# Altium project ANT_Miner_V1.3.PrjPCB (part 1 of 2)
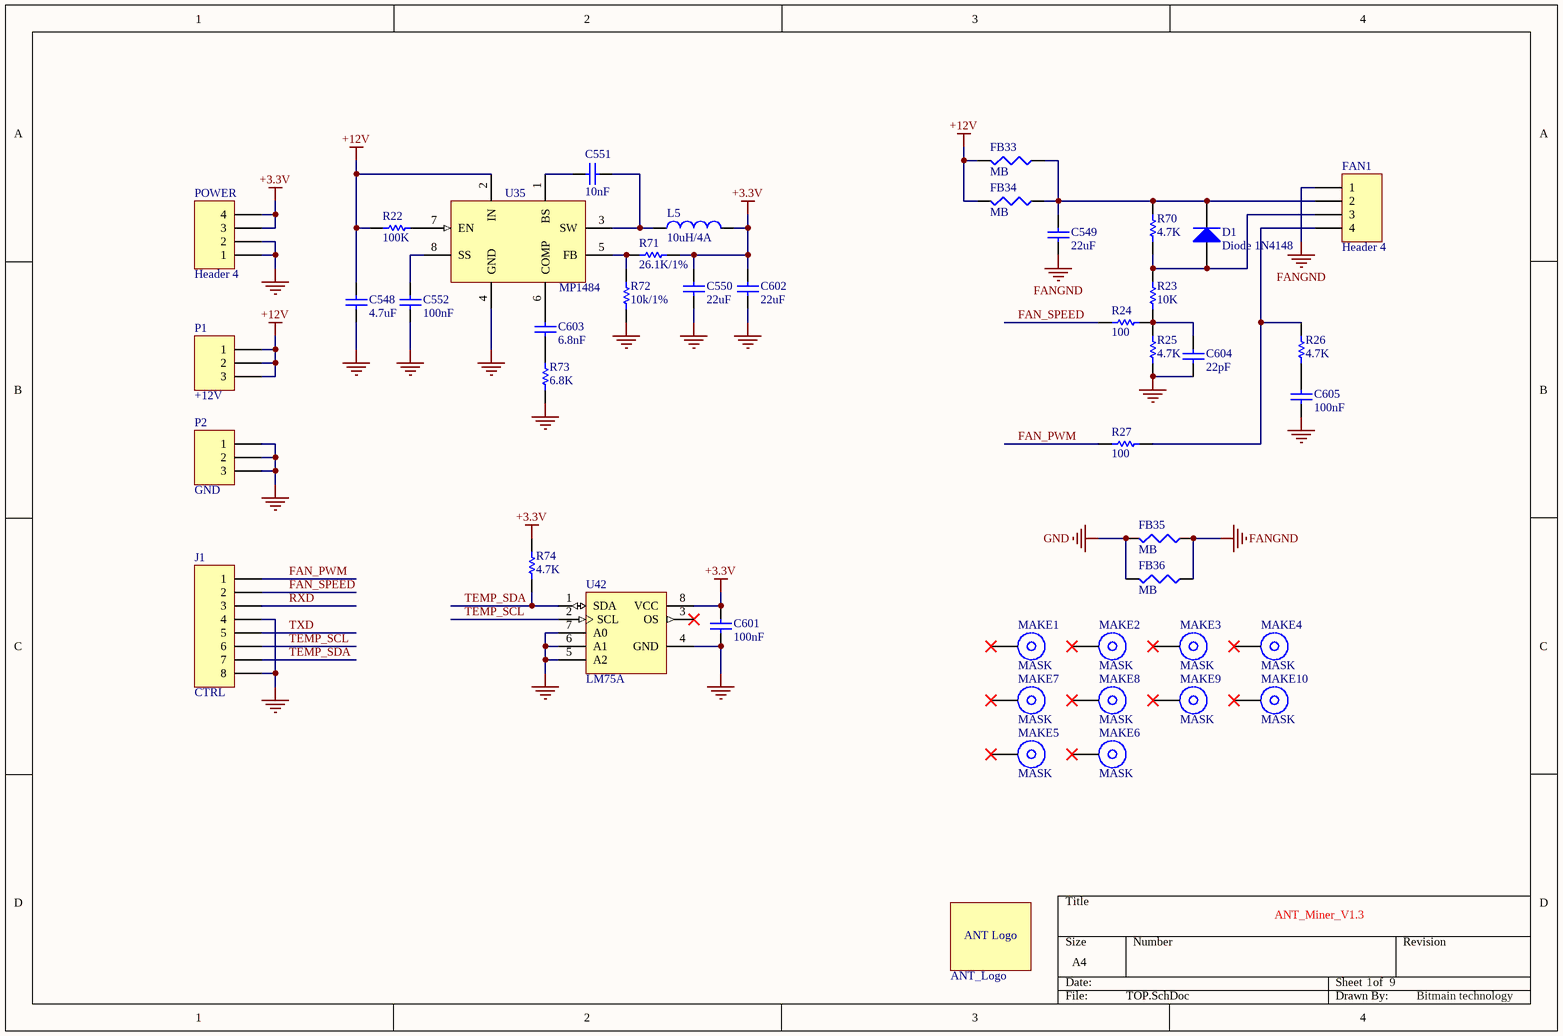
[diagram p0: TOP.SchDoc]
9 sheets, 987 parts. Net scope: global (net labels, ports and power ports of the same name join across sheets).
Board file: BitMainTech_V1.3.PcbDoc
Sheets:
  TOP.SchDoc
  HashPower1.SchDoc
  HashPower2.SchDoc
  HashPower3.SchDoc
  HashPower4.SchDoc
  HashUnit1.SchDoc
  HashUnit2.SchDoc
  HashUnit3.SchDoc
  HashUnit4.SchDoc

## Sheet TOP.SchDoc: ANT_Miner_V1.3
size A4; Date: 2013/11/20; DrawnBy: Bitmain technology; SheetNumber: 1; SheetTotal: 9

### Parts
?  ANT_Logo  [ANT_Logo_930x370]
C548  4.7uF  [CAP1210(3225)_TAN]
C549  22uF  [CAP1210(3225)_TAN]
C550  22uF  [CAP1210(3225)_TAN]
C551  10nF  [CC0603(1608)]
C552  100nF  [CC0603(1608)]
C601  100nF  [CC0603(1608)]
C602  22uF  [CAP1210(3225)_TAN]
C603  6.8nF  [CC0603(1608)]
C604  22pF  [CC0603(1608)]
C605  100nF  [CC0603(1608)]
D1  Diode 1N4148  [CD3216-1206]
FAN1  Header 4  [4PINFAN]
FB33  MB  [INDC3216L]
FB34  MB  [INDC3216L]
FB35  MB  [INDC3216L]
FB36  MB  [INDC3216L]
J1  CTRL  [8Pin_180]
L5  10uH/4A  [SMD_L_7.4x7.4]
MAKE1  MASK  [MASK]
MAKE2  MASK  [MASK]
MAKE3  MASK  [MASK]
MAKE4  MASK  [MASK]
MAKE5  MASK  [MASK]
MAKE6  MASK  [MASK]
MAKE7  MASK  [MASK]
MAKE8  MASK  [MASK]
MAKE9  MASK  [MASK]
MAKE10  MASK  [MASK]
P1  +12V  [TERMINAL_3]
P2  GND  [TERMINAL_3]
POWER  Header 4  [4Pin_180]
R22  100K  [RR0603(1608)]
R23  10K  [RR0603(1608)]
R24  100  [RR0603(1608)]
R25  4.7K  [RR0603(1608)]
R26  4.7K  [RR0603(1608)]
R27  100  [RR0603(1608)]
R70  4.7K  [RR0603(1608)]
R71  26.1K/1%  [RR0603(1608)]
R72  10k/1%  [RR0603(1608)]
R73  6.8K  [RR0603(1608)]
R74  4.7K  [RR0603(1608)]
U35  MP1484  [SOIC8L]
U42  LM75A  [SO8_L]

### Nets
+3.3V: C550.2 C601.1 C602.2 L5.2 POWER.3 POWER.4 R71.1 R74.2 U42.8(VCC)
+12V: C548.2 FB33.2 FB34.2 P1.1 P1.2 P1.3 R22.2 U35.2(IN)
FANGND: C549.1 FAN1.1 FB35.1 FB36.1
GND: C548.1 C550.1 C552.2 C601.2 C602.1 C604.2 C605.2 FB35.2 FB36.2 J1.4 J1.8 P2.1 P2.2 P2.3 POWER.1 POWER.2 R25.1 R72.1 R73.1 U35.0 U35.4(GND) U42.4(GND) U42.5(A2) U42.6(A1) U42.7(A0)
FAN_PWM: J1.1 R27.2
FAN_SPEED: J1.2 R24.2
RXD: J1.3
TEMP_SCL: J1.6 U42.2(SCL)
TEMP_SDA: J1.7 R74.1 U42.1(SDA)
TXD: J1.5
NetC549_2: C549.2 D1.2(K) FAN1.2 FB33.1 FB34.1 R70.2
NetC551_1: C551.1 U35.1(BS)
NetC551_2: C551.2 L5.1 U35.3(SW)
NetC552_1: C552.1 U35.8(SS)
NetC603_1: C603.1 U35.6(COMP)
NetC603_2: C603.2 R73.2
NetC604_1: C604.1 R23.2 R24.1 R25.2
NetC605_1: C605.1 R26.1
NetD1_1: D1.1(A) FAN1.3 R23.1 R70.1
NetFAN1_4: FAN1.4 R26.2 R27.1
NetR22_1: R22.1 U35.7(EN)
NetR71_2: R71.2 R72.2 U35.5(FB)

Not connected (* = marked no-connect by the designer): MAKE1 1*; MAKE2 1*; MAKE3 1*; MAKE4 1*; MAKE5 1*; MAKE6 1*; MAKE7 1*; MAKE8 1*; MAKE9 1*; MAKE10 1*; U42 3(OS)*

### Notes on the sheet
- (in symbol ANT_Logo) ANT Logo

### Library data of the parts
C548-C552 C601-C605 = Cap Semi: Capacitor (Semiconductor SIM Model); Published: 8-Jun-2000; LatestRevisionDate: 29-May-2009; LatestRevisionNote: IPC-7351 Footprint Added.; PackageReference: C1206; Publisher: Altium Limited; PackageDescription: Chip Capacitor
  C548: Value: 4.7uF
  C549 C550 C602: Value: 22uF
  C551: Value: 10nF
  C552 C601 C605: Value: 100nF
  C603: Value: 6.8nF
  C604: Value: 22pF
D1 = Diode 1N4148: High Conductance Fast Diode; Published: 8-Jun-2000; LatestRevisionDate: 17-Jul-2002; LatestRevisionNote: Re-released for DXP Platform.; DatasheetVersion: 1997; PackageReference: DO-35; Publisher: Altium Limited; PackageDescription: Diode, Axial; Body 3.8 x 1.9 mm (LxDia. max), Lead Dia. 0.53 mm (max); Code_JEDEC: DO-204-AH; ComponentLink1Description: Manufacturer Link; ComponentLink1URL: http://www.fairchildsemi.com/; ComponentLink2Description: Datasheet; ComponentLink2URL: http://www.fairchildsemi.com/ds/1N%2F1N4148.pdf
FAN1 POWER = Header 4: Header, 4-Pin; LatestRevisionDate: 17-Jul-2002; LatestRevisionNote: Re-released for DXP Platform.; Publisher: Altium Limited
FB33-FB36 = Res3: Resistor; Published: 8-Jun-2000; LatestRevisionDate: 29-May-2009; LatestRevisionNote: IPC-7351 Footprint Added.; PackageReference: J1-0603; Publisher: Altium Limited; PackageDescription: Chip Resistor; Value: MB
J1 = Header 8: Header, 8-Pin; LatestRevisionDate: 17-Jul-2002; LatestRevisionNote: Re-released for DXP Platform.; Publisher: Altium Limited
L5 = Inductor: Code_IEC: 1005; Published: 8-Jun-2000; LatestRevisionDate: 29-May-2009; LatestRevisionNote: IPC-7351 Footprint Added.; PackageReference: 0402-A; Publisher: Altium Limited; PackageDescription: Chip Inductor; Code_JEITA: 0402; Value: 10uH/4A
P1 P2 = Header 3: Header, 3-Pin; LatestRevisionDate: 17-Jul-2002; LatestRevisionNote: Re-released for DXP Platform.; Publisher: Altium Limited
R22-R27 R70-R74 = Res1: Resistor; Published: 8-Jun-2000; LatestRevisionDate: 17-Jul-2002; LatestRevisionNote: Re-released for DXP Platform.; PackageReference: AXIAL-0.3; Publisher: Altium Limited; PackageDescription: Axial Device, Thru-Hole; 2 Leads; 0.3 in Pin Spacing
  R22: Value: 100K
  R23: Value: 10K
  R24 R27: Value: 100
  R25 R26 R70 R74: Value: 4.7K
  R71: Value: 26.1K/1%
  R72: Value: 10k/1%
  R73: Value: 6.8K
U42 = LM75A: NXP Digital temperature sensor and thermal watchdog

## Sheet HashPower1.SchDoc: ANT_Miner_V1.3
size A4; Date: 2013/11/20; DrawnBy: Bitmain Technology; SheetNumber: 2; SheetTotal: 9
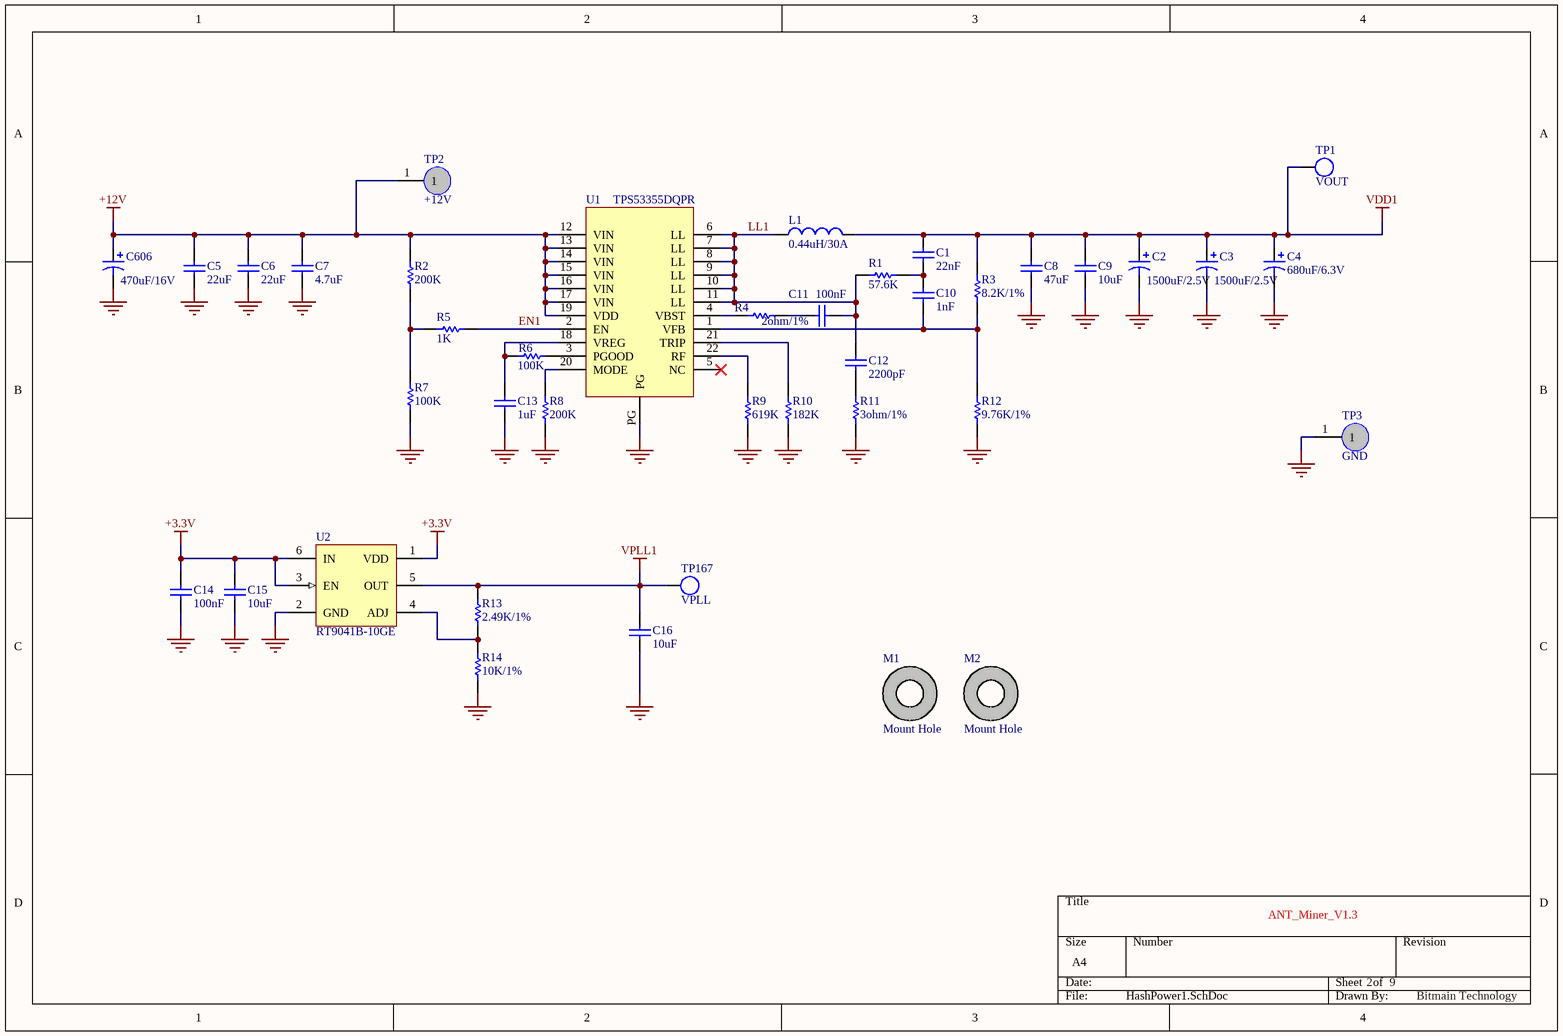
[diagram p1: HashPower1.SchDoc]

### Parts
C1  22nF  [CC0603(1608)]
C2  value 1500uF/2.5V  [F12]  (hidden comment: 1500uF/4V)
C3  value 1500uF/2.5V  [F12]  (hidden comment: 1500uF/4V)
C4  680uF/6.3V  [D]
C5  22uF  [CC1210(3225)]
C6  22uF  [CC1210(3225)]
C7  4.7uF  [CC0805(2012)]
C8  47uF  [CAPC3225L]
C9  10uF  [CAPC2012L]
C10  1nF  [CC0603(1608)]
C11  100nF  [CC0603(1608)]
C12  2200pF  [CC0603(1608)]
C13  1uF  [CC0603(1608)]
C14  100nF  [CC0603(1608)]
C15  10uF  [CC0805(2012)]
C16  10uF  [CC0805(2012)]
C606  470uF/16V  [E12]
L1  0.44uH/30A  [IHLP5050]
M1  Mount Hole  [HOLE_3.2]
M2  Mount Hole  [HOLE_3.2]
R1  57.6K  [RR0603(1608)]
R2  200K  [RR0603(1608)]
R3  8.2K/1%  [RR0603(1608)]
R4  value 2ohm/1%  [RR0603(1608)]  (hidden comment: 2)
R5  1K  [RR0603(1608)]
R6  100K  [RR0603(1608)]
R7  100K  [RR0603(1608)]
R8  200K  [RR0603(1608)]
R9  619K  [RR0603(1608)]
R10  182K  [RR0603(1608)]
R11  value 3ohm/1%  [RR0603(1608)]  (hidden comment: 3)
R12  9.76K/1%  [RR0603(1608)]
R13  2.49K/1%  [RR0603(1608)]
R14  10K/1%  [RR0603(1608)]
TP1  VOUT  [TP_SMD_1.0]
TP2  +12V  [TP]
TP3  GND  [TP]
TP167  VPLL  [TP_SMD_1.0]
U1  TPS53355DQPR  [TPS53355]
U2  RT9041B-10GE  [SOT23-6_L]

### Nets
+3.3V: C14.2 C15.2 U2.1(VDD) U2.3(EN) U2.6(IN)
+12V: C5.1 C6.1 C7.1 C606.1 R2.1 TP2.1 U1.12(VIN) U1.13(VIN) U1.14(VIN) U1.15(VIN) U1.16(VIN) U1.17(VIN) U1.19(VDD)
GND: C2.2 C3.2 C4.2 C5.2 C6.2 C7.2 C8.1 C9.1 C13.2 C14.1 C15.1 C16.1 C606.2 R7.2 R8.2 R9.2 R10.2 R11.2 R12.2 R14.1 TP3.1 U1.PG U2.2(GND)
VDD1: C1.1 C2.1 C3.1 C4.1 C8.2 C9.2 L1.2 R3.1 TP1.1
VPLL1: C16.2 R13.2 TP167.1 U2.5(OUT)
EN1: R5.2 U1.2(EN)
LL1: C11.2 C12.1 L1.1 R1.1 U1.6(LL) U1.7(LL) U1.8(LL) U1.9(LL) U1.10(LL) U1.11(LL)
NetC1_2: C1.2 C10.1 R1.2
NetC10_2: C10.2 R3.2 R12.1 U1.1(VFB)
NetC11_1: C11.1 R4.2
NetC12_2: C12.2 R11.1
NetC13_1: C13.1 R6.1 U1.18(VREG)
NetR2_2: R2.2 R5.1 R7.1
NetR4_1: R4.1 U1.4(VBST)
NetR6_2: R6.2 U1.3(PGOOD)
NetR8_1: R8.1 U1.20(MODE)
NetR9_1: R9.1 U1.22(RF)
NetR10_1: R10.1 U1.21(TRIP)
NetR13_1: R13.1 R14.2 U2.4(ADJ)

Not connected (* = marked no-connect by the designer): M1 0(PIN); M2 0(PIN); U1 5(NC)*

### Library data of the parts
C1 C5-C7 C10-C13 = Cap: Capacitor
  C1: Value: 22nF
  C5 C6: Value: 22uF
  C7: Value: 4.7uF
  C10: Value: 1nF
  C11: Value: 100nF
  C12: Value: 2200pF
  C13: Value: 1uF
C2 C3 C606 = Cap Pol2: Polarized Capacitor (SMD)
  C606: Value: 470uF/16V
C4 = Cap Pol3: Polarized Capacitor (Surface Mount); Published: 8-Jun-2000; LatestRevisionDate: 29-May-2009; LatestRevisionNote: IPC-7351 Footprint Added.; PackageReference: C0805; Publisher: Altium Limited; PackageDescription: Chip Capacitor; Value: 680uF/6.3V
C8 C9 C14-C16 = Cap Semi: Capacitor (Semiconductor SIM Model); Published: 8-Jun-2000; LatestRevisionDate: 29-May-2009; LatestRevisionNote: IPC-7351 Footprint Added.; PackageReference: C1206; Publisher: Altium Limited; PackageDescription: Chip Capacitor
  C8: Value: 47uF
  C9 C15 C16: Value: 10uF
  C14: Value: 100nF
L1 = Inductor: Code_IEC: 1005; Published: 8-Jun-2000; LatestRevisionDate: 29-May-2009; LatestRevisionNote: IPC-7351 Footprint Added.; PackageReference: 0402-A; Publisher: Altium Limited; PackageDescription: Chip Inductor; Code_JEITA: 0402; Value: 0.44uH/30A
M1 M2 = M_Hole
R1-R14 = Res1: Resistor
  R1: Value: 57.6K
  R2 R8: Value: 200K
  R3: Value: 8.2K/1%
  R5: Value: 1K
  R6 R7: Value: 100K
  R9: Value: 619K
  R10: Value: 182K
  R12: Value: 9.76K/1%
  R13: Published: 8-Jun-2000; LatestRevisionDate: 17-Jul-2002; LatestRevisionNote: Re-released for DXP Platform.; PackageReference: AXIAL-0.3; Publisher: Altium Limited; PackageDescription: Axial Device, Thru-Hole; 2 Leads; 0.3 in Pin Spacing; Value: 2.49K/1%
  R14: Published: 8-Jun-2000; LatestRevisionDate: 17-Jul-2002; LatestRevisionNote: Re-released for DXP Platform.; PackageReference: AXIAL-0.3; Publisher: Altium Limited; PackageDescription: Axial Device, Thru-Hole; 2 Leads; 0.3 in Pin Spacing; Value: 10K/1%
TP1 TP167 = TP: Test Point
  TP1: Value: VOUT
  TP167: Value: VPLL
TP2 TP3 = TP
U1 = TPS53355: TI DC-DC,Output 30A.

## Sheet HashPower2.SchDoc: ANT_Miner_V1.3
size A4; Date: 2013/11/20; DrawnBy: Bitmain Technology; SheetNumber: 3; SheetTotal: 9
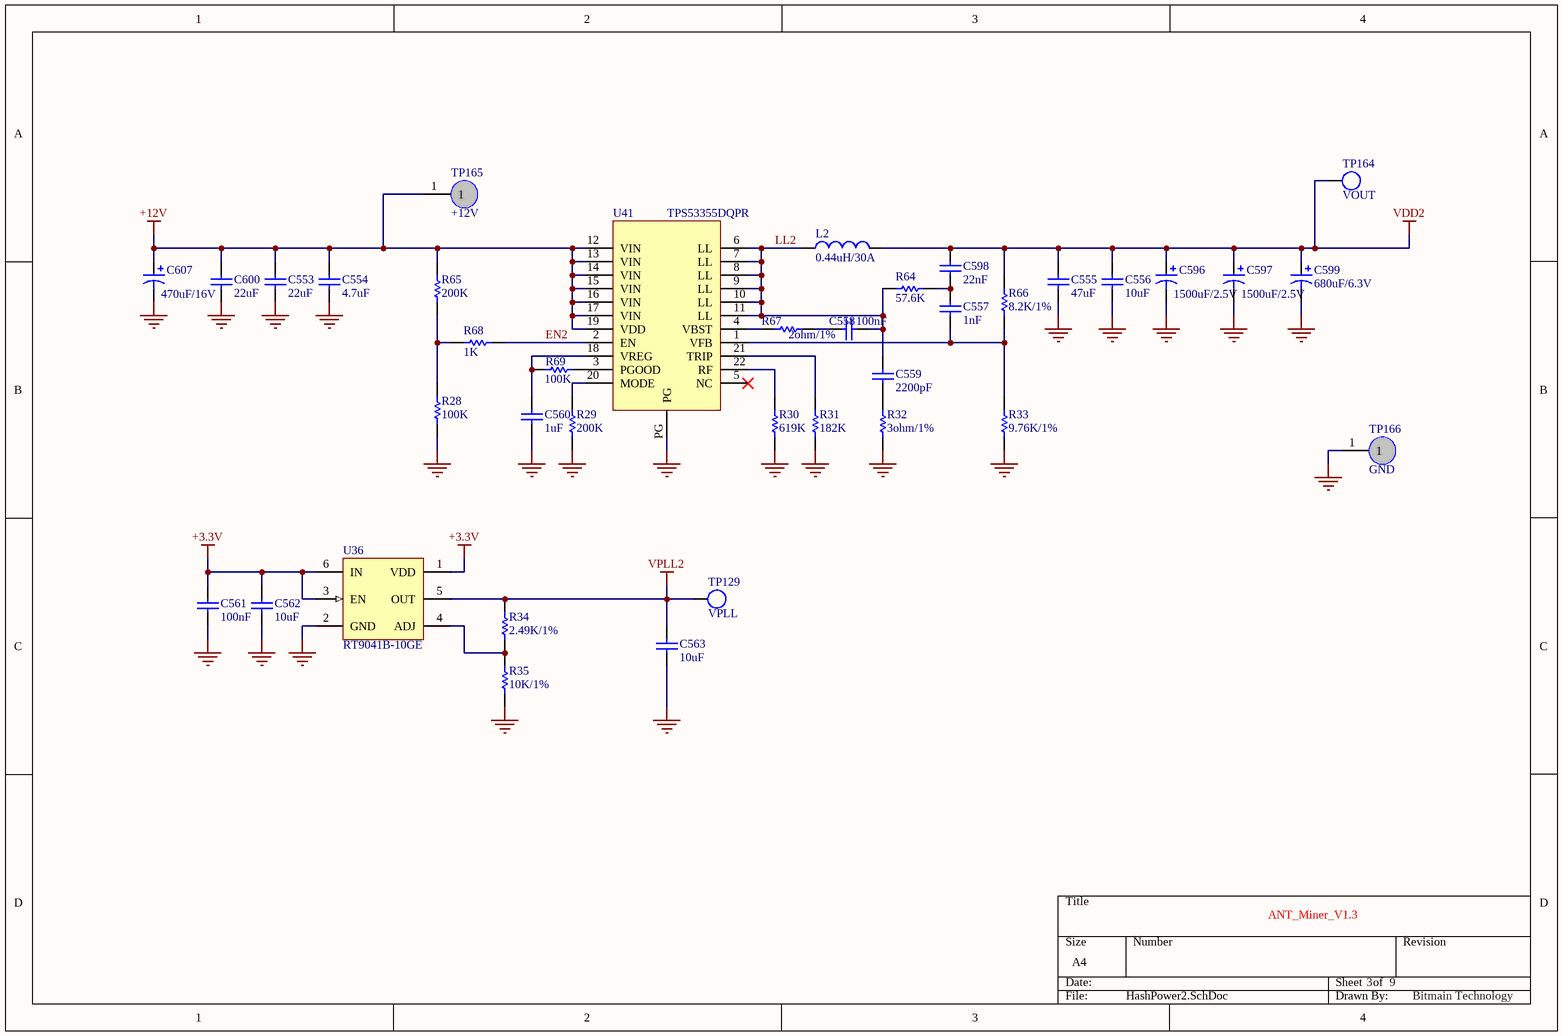
[diagram p2: HashPower2.SchDoc]

### Parts
C553  22uF  [CC1210(3225)]
C554  4.7uF  [CC0805(2012)]
C555  47uF  [CAPC3225L]
C556  10uF  [CAPC2012L]
C557  1nF  [CC0603(1608)]
C558  100nF  [CC0603(1608)]
C559  2200pF  [CC0603(1608)]
C560  1uF  [CC0603(1608)]
C561  100nF  [CC0603(1608)]
C562  10uF  [CC0805(2012)]
C563  10uF  [CC0805(2012)]
C596  value 1500uF/2.5V  [F12]  (hidden comment: 1500uF/4V)
C597  value 1500uF/2.5V  [F12]  (hidden comment: 1500uF/4V)
C598  22nF  [CC0603(1608)]
C599  680uF/6.3V  [D]
C600  22uF  [CC1210(3225)]
C607  470uF/16V  [E12]
L2  0.44uH/30A  [IHLP5050]
R28  100K  [RR0603(1608)]
R29  200K  [RR0603(1608)]
R30  619K  [RR0603(1608)]
R31  182K  [RR0603(1608)]
R32  value 3ohm/1%  [RR0603(1608)]  (hidden comment: 3)
R33  9.76K/1%  [RR0603(1608)]
R34  2.49K/1%  [RR0603(1608)]
R35  10K/1%  [RR0603(1608)]
R64  57.6K  [RR0603(1608)]
R65  200K  [RR0603(1608)]
R66  8.2K/1%  [RR0603(1608)]
R67  value 2ohm/1%  [RR0603(1608)]  (hidden comment: 2)
R68  1K  [RR0603(1608)]
R69  100K  [RR0603(1608)]
TP129  VPLL  [TP_SMD_1.0]
TP164  VOUT  [TP_SMD_1.0]
TP165  +12V  [TP]
TP166  GND  [TP]
U36  RT9041B-10GE  [SOT23-6_L]
U41  TPS53355DQPR  [TPS53355]

### Nets
+3.3V: C561.2 C562.2 U36.1(VDD) U36.3(EN) U36.6(IN)
+12V: C553.1 C554.1 C600.1 C607.1 R65.1 TP165.1 U41.12(VIN) U41.13(VIN) U41.14(VIN) U41.15(VIN) U41.16(VIN) U41.17(VIN) U41.19(VDD)
GND: C553.2 C554.2 C555.1 C556.1 C560.2 C561.1 C562.1 C563.1 C596.2 C597.2 C599.2 C600.2 C607.2 R28.2 R29.2 R30.2 R31.2 R32.2 R33.2 R35.1 TP166.1 U36.2(GND) U41.PG
VDD2: C555.2 C556.2 C596.1 C597.1 C598.1 C599.1 L2.2 R66.1 TP164.1
VPLL2: C563.2 R34.2 TP129.1 U36.5(OUT)
EN2: R68.2 U41.2(EN)
LL2: C558.2 C559.1 L2.1 R64.1 U41.6(LL) U41.7(LL) U41.8(LL) U41.9(LL) U41.10(LL) U41.11(LL)
NetC557_1: C557.1 C598.2 R64.2
NetC557_2: C557.2 R33.1 R66.2 U41.1(VFB)
NetC558_1: C558.1 R67.2
NetC559_2: C559.2 R32.1
NetC560_1: C560.1 R69.1 U41.18(VREG)
NetR28_1: R28.1 R65.2 R68.1
NetR29_1: R29.1 U41.20(MODE)
NetR30_1: R30.1 U41.22(RF)
NetR31_1: R31.1 U41.21(TRIP)
NetR34_1: R34.1 R35.2 U36.4(ADJ)
NetR67_1: R67.1 U41.4(VBST)
NetR69_2: R69.2 U41.3(PGOOD)

Not connected (* = marked no-connect by the designer): U41 5(NC)*

### Library data of the parts
C553 C554 C557-C560 C598 C600 = Cap: Capacitor
  C553 C600: Value: 22uF
  C554: Value: 4.7uF
  C557: Value: 1nF
  C558: Value: 100nF
  C559: Value: 2200pF
  C560: Value: 1uF
  C598: Value: 22nF
C555 C556 C561-C563 = Cap Semi: Capacitor (Semiconductor SIM Model); Published: 8-Jun-2000; LatestRevisionDate: 29-May-2009; LatestRevisionNote: IPC-7351 Footprint Added.; PackageReference: C1206; Publisher: Altium Limited; PackageDescription: Chip Capacitor
  C555: Value: 47uF
  C556 C562 C563: Value: 10uF
  C561: Value: 100nF
C596 C597 C607 = Cap Pol2: Polarized Capacitor (SMD)
  C607: Value: 470uF/16V
C599 = Cap Pol3: Polarized Capacitor (Surface Mount); Published: 8-Jun-2000; LatestRevisionDate: 29-May-2009; LatestRevisionNote: IPC-7351 Footprint Added.; PackageReference: C0805; Publisher: Altium Limited; PackageDescription: Chip Capacitor; Value: 680uF/6.3V
L2 = Inductor: Code_IEC: 1005; Published: 8-Jun-2000; LatestRevisionDate: 29-May-2009; LatestRevisionNote: IPC-7351 Footprint Added.; PackageReference: 0402-A; Publisher: Altium Limited; PackageDescription: Chip Inductor; Code_JEITA: 0402; Value: 0.44uH/30A
R28-R35 R64-R69 = Res1: Resistor
  R28 R69: Value: 100K
  R29 R65: Value: 200K
  R30: Value: 619K
  R31: Value: 182K
  R33: Value: 9.76K/1%
  R34: Published: 8-Jun-2000; LatestRevisionDate: 17-Jul-2002; LatestRevisionNote: Re-released for DXP Platform.; PackageReference: AXIAL-0.3; Publisher: Altium Limited; PackageDescription: Axial Device, Thru-Hole; 2 Leads; 0.3 in Pin Spacing; Value: 2.49K/1%
  R35: Published: 8-Jun-2000; LatestRevisionDate: 17-Jul-2002; LatestRevisionNote: Re-released for DXP Platform.; PackageReference: AXIAL-0.3; Publisher: Altium Limited; PackageDescription: Axial Device, Thru-Hole; 2 Leads; 0.3 in Pin Spacing; Value: 10K/1%
  R64: Value: 57.6K
  R66: Value: 8.2K/1%
  R68: Value: 1K
TP129 TP164 = TP: Test Point
  TP129: Value: VPLL
  TP164: Value: VOUT
TP165 TP166 = TP
U41 = TPS53355

## Sheet HashPower3.SchDoc: ANT_Miner_V1.3
size A4; Date: 2013/11/20; DrawnBy: Bitmain Technology; SheetNumber: 4; SheetTotal: 9
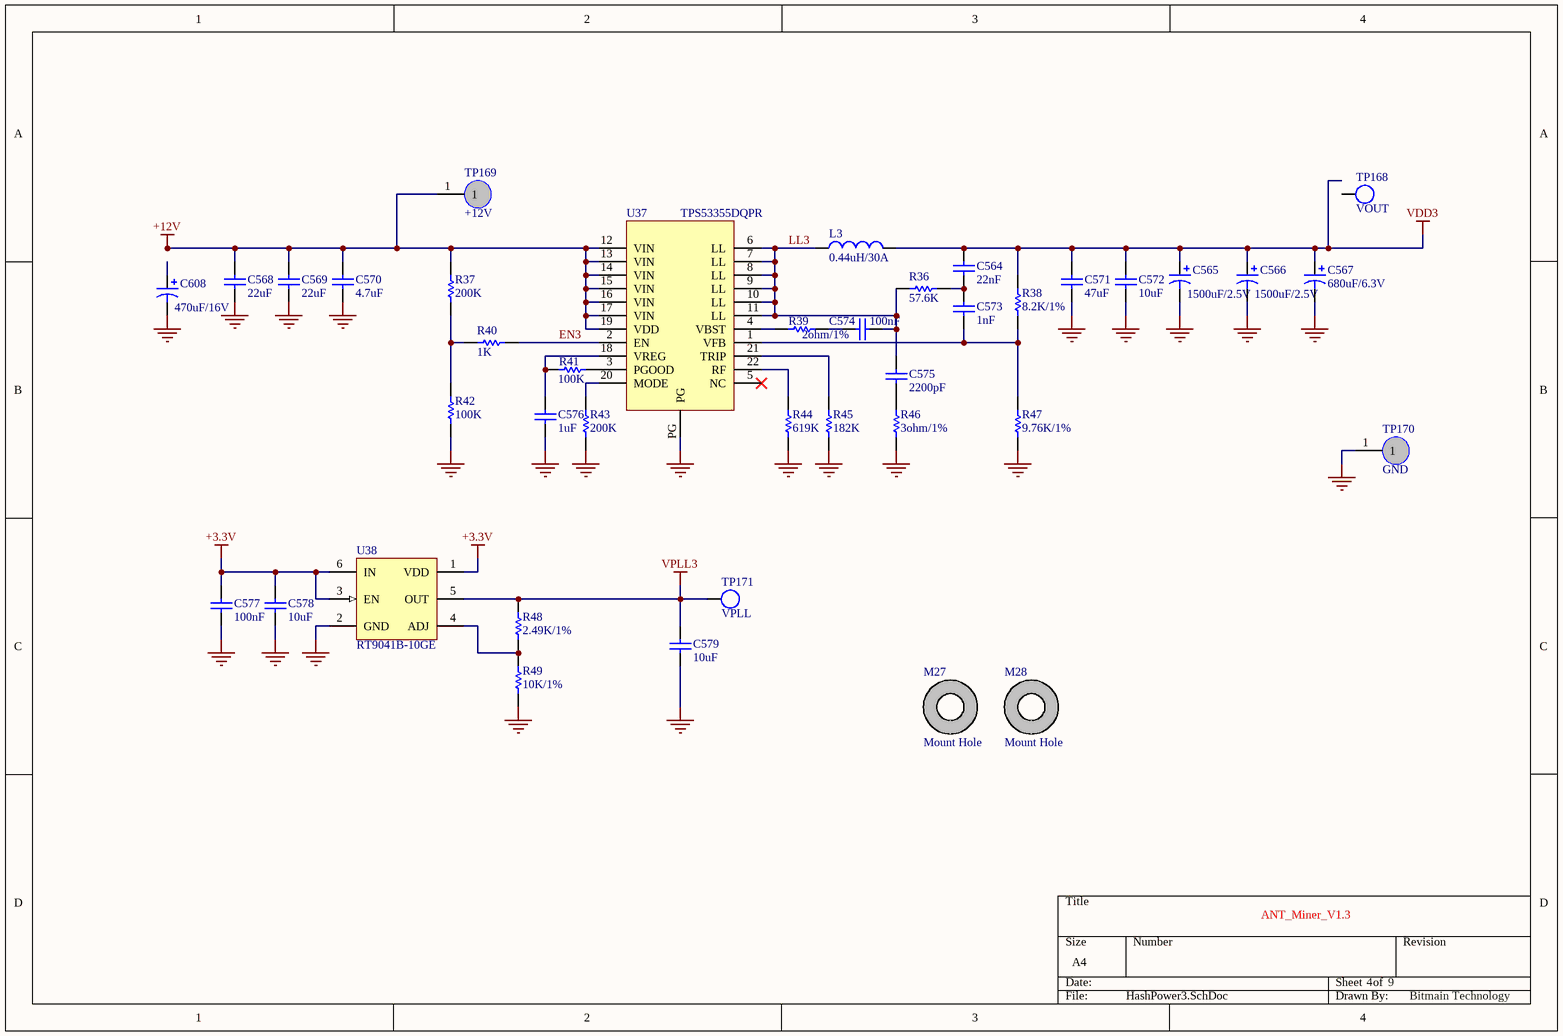
[diagram p3: HashPower3.SchDoc]

### Parts
C564  22nF  [CC0603(1608)]
C565  value 1500uF/2.5V  [F12]  (hidden comment: 1500uF/4V)
C566  value 1500uF/2.5V  [F12]  (hidden comment: 1500uF/4V)
C567  680uF/6.3V  [D]
C568  22uF  [CC1210(3225)]
C569  22uF  [CC1210(3225)]
C570  4.7uF  [CC0805(2012)]
C571  47uF  [CAPC3225L]
C572  10uF  [CAPC2012L]
C573  1nF  [CC0603(1608)]
C574  100nF  [CC0603(1608)]
C575  2200pF  [CC0603(1608)]
C576  1uF  [CC0603(1608)]
C577  100nF  [CC0603(1608)]
C578  10uF  [CC0805(2012)]
C579  10uF  [CC0805(2012)]
C608  470uF/16V  [E12]
L3  0.44uH/30A  [IHLP5050]
M27  Mount Hole  [HOLE_3.2]
M28  Mount Hole  [HOLE_3.2]
R36  57.6K  [RR0603(1608)]
R37  200K  [RR0603(1608)]
R38  8.2K/1%  [RR0603(1608)]
R39  value 2ohm/1%  [RR0603(1608)]  (hidden comment: 2)
R40  1K  [RR0603(1608)]
R41  100K  [RR0603(1608)]
R42  100K  [RR0603(1608)]
R43  200K  [RR0603(1608)]
R44  619K  [RR0603(1608)]
R45  182K  [RR0603(1608)]
R46  value 3ohm/1%  [RR0603(1608)]  (hidden comment: 3)
R47  9.76K/1%  [RR0603(1608)]
R48  2.49K/1%  [RR0603(1608)]
R49  10K/1%  [RR0603(1608)]
TP168  VOUT  [TP_SMD_1.0]
TP169  +12V  [TP]
TP170  GND  [TP]
TP171  VPLL  [TP_SMD_1.0]
U37  TPS53355DQPR  [TPS53355]
U38  RT9041B-10GE  [SOT23-6_L]

### Nets
+3.3V: C577.2 C578.2 U38.1(VDD) U38.3(EN) U38.6(IN)
+12V: C568.1 C569.1 C570.1 R37.1 TP169.1 U37.12(VIN) U37.13(VIN) U37.14(VIN) U37.15(VIN) U37.16(VIN) U37.17(VIN) U37.19(VDD)
GND: C565.2 C566.2 C567.2 C568.2 C569.2 C570.2 C571.1 C572.1 C576.2 C577.1 C578.1 C579.1 C608.2 R42.2 R43.2 R44.2 R45.2 R46.2 R47.2 R49.1 TP170.1 U37.PG U38.2(GND)
VDD3: C564.1 C565.1 C566.1 C567.1 C571.2 C572.2 L3.2 R38.1
VPLL3: C579.2 R48.2 TP171.1 U38.5(OUT)
EN3: R40.2 U37.2(EN)
LL3: C574.2 C575.1 L3.1 R36.1 U37.6(LL) U37.7(LL) U37.8(LL) U37.9(LL) U37.10(LL) U37.11(LL)
NetC564_2: C564.2 C573.1 R36.2
NetC573_2: C573.2 R38.2 R47.1 U37.1(VFB)
NetC574_1: C574.1 R39.2
NetC575_2: C575.2 R46.1
NetC576_1: C576.1 R41.1 U37.18(VREG)
NetR37_2: R37.2 R40.1 R42.1
NetR39_1: R39.1 U37.4(VBST)
NetR41_2: R41.2 U37.3(PGOOD)
NetR43_1: R43.1 U37.20(MODE)
NetR44_1: R44.1 U37.22(RF)
NetR45_1: R45.1 U37.21(TRIP)
NetR48_1: R48.1 R49.2 U38.4(ADJ)

Not connected (* = marked no-connect by the designer): C608 1; M27 0(PIN); M28 0(PIN); TP168 1; U37 5(NC)*

### Library data of the parts
C564 C568-C570 C573-C576 = Cap: Capacitor
  C564: Value: 22nF
  C568 C569: Value: 22uF
  C570: Value: 4.7uF
  C573: Value: 1nF
  C574: Value: 100nF
  C575: Value: 2200pF
  C576: Value: 1uF
C565 C566 C608 = Cap Pol2: Polarized Capacitor (SMD)
  C608: Value: 470uF/16V
C567 = Cap Pol3: Polarized Capacitor (Surface Mount); Published: 8-Jun-2000; LatestRevisionDate: 29-May-2009; LatestRevisionNote: IPC-7351 Footprint Added.; PackageReference: C0805; Publisher: Altium Limited; PackageDescription: Chip Capacitor; Value: 680uF/6.3V
C571 C572 C577-C579 = Cap Semi: Capacitor (Semiconductor SIM Model); Published: 8-Jun-2000; LatestRevisionDate: 29-May-2009; LatestRevisionNote: IPC-7351 Footprint Added.; PackageReference: C1206; Publisher: Altium Limited; PackageDescription: Chip Capacitor
  C571: Value: 47uF
  C572 C578 C579: Value: 10uF
  C577: Value: 100nF
L3 = Inductor: Code_IEC: 1005; Published: 8-Jun-2000; LatestRevisionDate: 29-May-2009; LatestRevisionNote: IPC-7351 Footprint Added.; PackageReference: 0402-A; Publisher: Altium Limited; PackageDescription: Chip Inductor; Code_JEITA: 0402; Value: 0.44uH/30A
M27 M28 = M_Hole
R36-R49 = Res1: Resistor
  R36: Value: 57.6K
  R37 R43: Value: 200K
  R38: Value: 8.2K/1%
  R40: Value: 1K
  R41 R42: Value: 100K
  R44: Value: 619K
  R45: Value: 182K
  R47: Value: 9.76K/1%
  R48: Published: 8-Jun-2000; LatestRevisionDate: 17-Jul-2002; LatestRevisionNote: Re-released for DXP Platform.; PackageReference: AXIAL-0.3; Publisher: Altium Limited; PackageDescription: Axial Device, Thru-Hole; 2 Leads; 0.3 in Pin Spacing; Value: 2.49K/1%
  R49: Published: 8-Jun-2000; LatestRevisionDate: 17-Jul-2002; LatestRevisionNote: Re-released for DXP Platform.; PackageReference: AXIAL-0.3; Publisher: Altium Limited; PackageDescription: Axial Device, Thru-Hole; 2 Leads; 0.3 in Pin Spacing; Value: 10K/1%
TP168 TP171 = TP: Test Point
  TP168: Value: VOUT
  TP171: Value: VPLL
TP169 TP170 = TP
U37 = TPS53355

## Sheet HashPower4.SchDoc: ANT_Miner_V1.3
size A4; Date: 2013/11/20; DrawnBy: Bitmain Technology; SheetNumber: 5; SheetTotal: 9
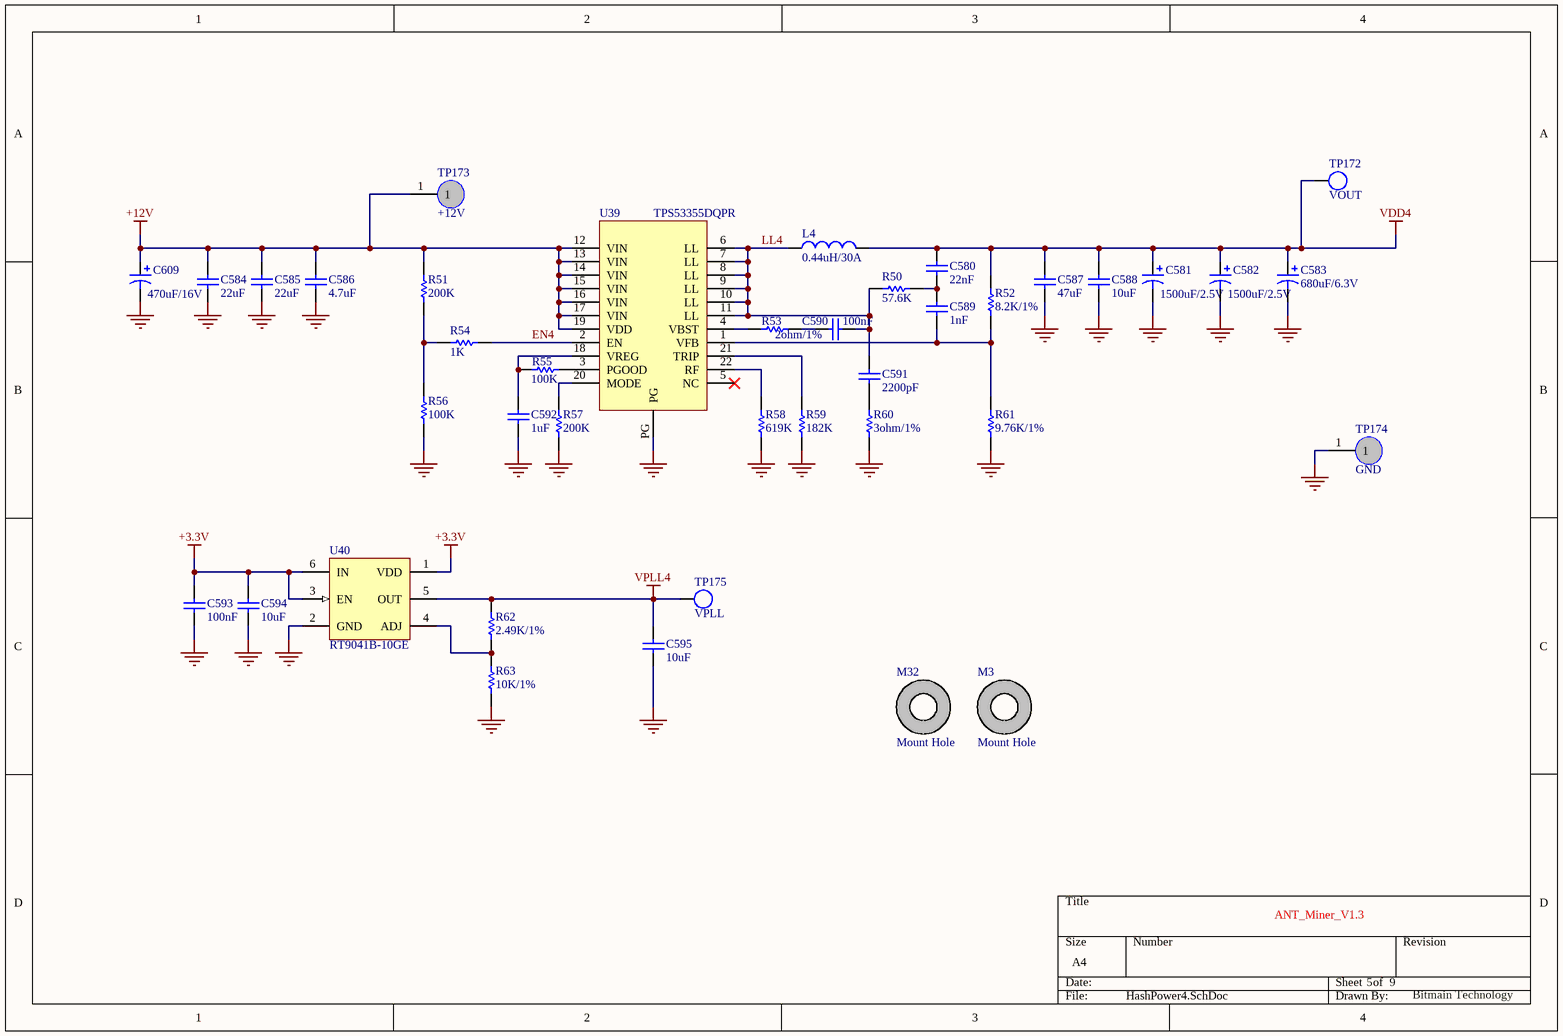
[diagram p4: HashPower4.SchDoc]

### Parts
C580  22nF  [CC0603(1608)]
C581  value 1500uF/2.5V  [F12]  (hidden comment: 1500uF/4V)
C582  value 1500uF/2.5V  [F12]  (hidden comment: 1500uF/4V)
C583  680uF/6.3V  [D]
C584  22uF  [CC1210(3225)]
C585  22uF  [CC1210(3225)]
C586  4.7uF  [CC0805(2012)]
C587  47uF  [CAPC3225L]
C588  10uF  [CAPC2012L]
C589  1nF  [CC0603(1608)]
C590  100nF  [CC0603(1608)]
C591  2200pF  [CC0603(1608)]
C592  1uF  [CC0603(1608)]
C593  100nF  [CC0603(1608)]
C594  10uF  [CC0805(2012)]
C595  10uF  [CC0805(2012)]
C609  470uF/16V  [E12]
L4  0.44uH/30A  [IHLP5050]
M3  Mount Hole  [HOLE_3.2]
M32  Mount Hole  [HOLE_3.2]
R50  57.6K  [RR0603(1608)]
R51  200K  [RR0603(1608)]
R52  8.2K/1%  [RR0603(1608)]
R53  value 2ohm/1%  [RR0603(1608)]  (hidden comment: 2)
R54  1K  [RR0603(1608)]
R55  100K  [RR0603(1608)]
R56  100K  [RR0603(1608)]
R57  200K  [RR0603(1608)]
R58  619K  [RR0603(1608)]
R59  182K  [RR0603(1608)]
R60  value 3ohm/1%  [RR0603(1608)]  (hidden comment: 3)
R61  9.76K/1%  [RR0603(1608)]
R62  2.49K/1%  [RR0603(1608)]
R63  10K/1%  [RR0603(1608)]
TP172  VOUT  [TP_SMD_1.0]
TP173  +12V  [TP]
TP174  GND  [TP]
TP175  VPLL  [TP_SMD_1.0]
U39  TPS53355DQPR  [TPS53355]
U40  RT9041B-10GE  [SOT23-6_L]

### Nets
+3.3V: C593.2 C594.2 U40.1(VDD) U40.3(EN) U40.6(IN)
+12V: C584.1 C585.1 C586.1 C609.1 R51.1 TP173.1 U39.12(VIN) U39.13(VIN) U39.14(VIN) U39.15(VIN) U39.16(VIN) U39.17(VIN) U39.19(VDD)
GND: C581.2 C582.2 C583.2 C584.2 C585.2 C586.2 C587.1 C588.1 C592.2 C593.1 C594.1 C595.1 C609.2 R56.2 R57.2 R58.2 R59.2 R60.2 R61.2 R63.1 TP174.1 U39.PG U40.2(GND)
VDD4: C580.1 C581.1 C582.1 C583.1 C587.2 C588.2 L4.2 R52.1 TP172.1
VPLL4: C595.2 R62.2 TP175.1 U40.5(OUT)
EN4: R54.2 U39.2(EN)
LL4: C590.2 C591.1 L4.1 R50.1 U39.6(LL) U39.7(LL) U39.8(LL) U39.9(LL) U39.10(LL) U39.11(LL)
NetC580_2: C580.2 C589.1 R50.2
NetC589_2: C589.2 R52.2 R61.1 U39.1(VFB)
NetC590_1: C590.1 R53.2
NetC591_2: C591.2 R60.1
NetC592_1: C592.1 R55.1 U39.18(VREG)
NetR51_2: R51.2 R54.1 R56.1
NetR53_1: R53.1 U39.4(VBST)
NetR55_2: R55.2 U39.3(PGOOD)
NetR57_1: R57.1 U39.20(MODE)
NetR58_1: R58.1 U39.22(RF)
NetR59_1: R59.1 U39.21(TRIP)
NetR62_1: R62.1 R63.2 U40.4(ADJ)

Not connected (* = marked no-connect by the designer): M3 0(PIN); M32 0(PIN); U39 5(NC)*

### Library data of the parts
C580 C584-C586 C589-C592 = Cap: Capacitor
  C580: Value: 22nF
  C584 C585: Value: 22uF
  C586: Value: 4.7uF
  C589: Value: 1nF
  C590: Value: 100nF
  C591: Value: 2200pF
  C592: Value: 1uF
C581 C582 C609 = Cap Pol2: Polarized Capacitor (SMD)
  C609: Value: 470uF/16V
C583 = Cap Pol3: Polarized Capacitor (Surface Mount); Published: 8-Jun-2000; LatestRevisionDate: 29-May-2009; LatestRevisionNote: IPC-7351 Footprint Added.; PackageReference: C0805; Publisher: Altium Limited; PackageDescription: Chip Capacitor; Value: 680uF/6.3V
C587 C588 C593-C595 = Cap Semi: Capacitor (Semiconductor SIM Model); Published: 8-Jun-2000; LatestRevisionDate: 29-May-2009; LatestRevisionNote: IPC-7351 Footprint Added.; PackageReference: C1206; Publisher: Altium Limited; PackageDescription: Chip Capacitor
  C587: Value: 47uF
  C588 C594 C595: Value: 10uF
  C593: Value: 100nF
L4 = Inductor: Code_IEC: 1005; Published: 8-Jun-2000; LatestRevisionDate: 29-May-2009; LatestRevisionNote: IPC-7351 Footprint Added.; PackageReference: 0402-A; Publisher: Altium Limited; PackageDescription: Chip Inductor; Code_JEITA: 0402; Value: 0.44uH/30A
M3 M32 = M_Hole
R50-R63 = Res1: Resistor
  R50: Value: 57.6K
  R51 R57: Value: 200K
  R52: Value: 8.2K/1%
  R54: Value: 1K
  R55 R56: Value: 100K
  R58: Value: 619K
  R59: Value: 182K
  R61: Value: 9.76K/1%
  R62: Published: 8-Jun-2000; LatestRevisionDate: 17-Jul-2002; LatestRevisionNote: Re-released for DXP Platform.; PackageReference: AXIAL-0.3; Publisher: Altium Limited; PackageDescription: Axial Device, Thru-Hole; 2 Leads; 0.3 in Pin Spacing; Value: 2.49K/1%
  R63: Published: 8-Jun-2000; LatestRevisionDate: 17-Jul-2002; LatestRevisionNote: Re-released for DXP Platform.; PackageReference: AXIAL-0.3; Publisher: Altium Limited; PackageDescription: Axial Device, Thru-Hole; 2 Leads; 0.3 in Pin Spacing; Value: 10K/1%
TP172 TP175 = TP: Test Point
  TP172: Value: VOUT
  TP175: Value: VPLL
TP173 TP174 = TP
U39 = TPS53355

## Sheet HashUnit1.SchDoc: ANT_Miner_V1.3
size A2; Date: 2013/11/20; DrawnBy: Bitmain Technology; SheetNumber: 6; SheetTotal: 9
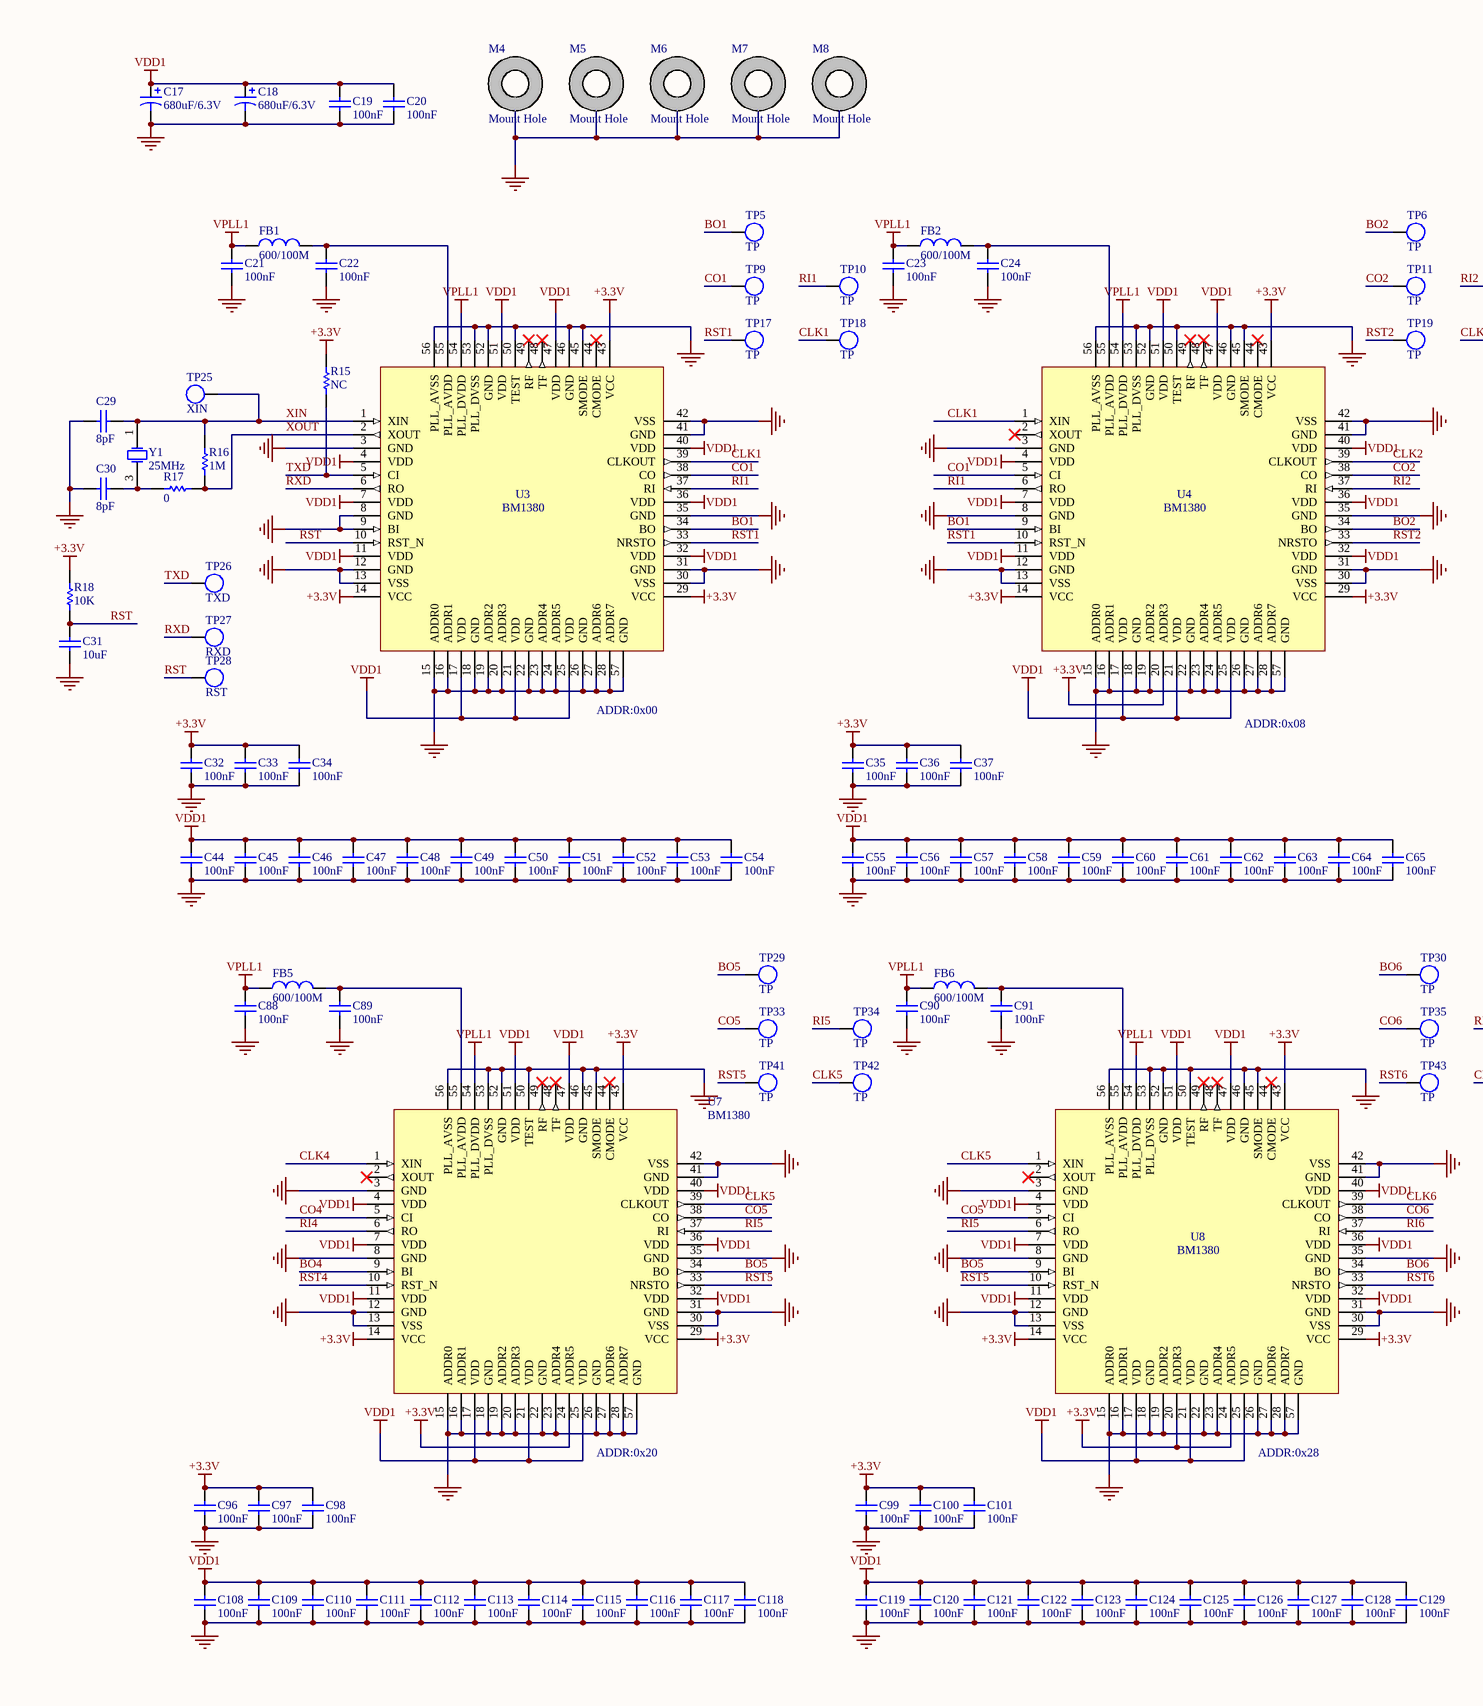
[diagram p5: HashUnit1.SchDoc, left]
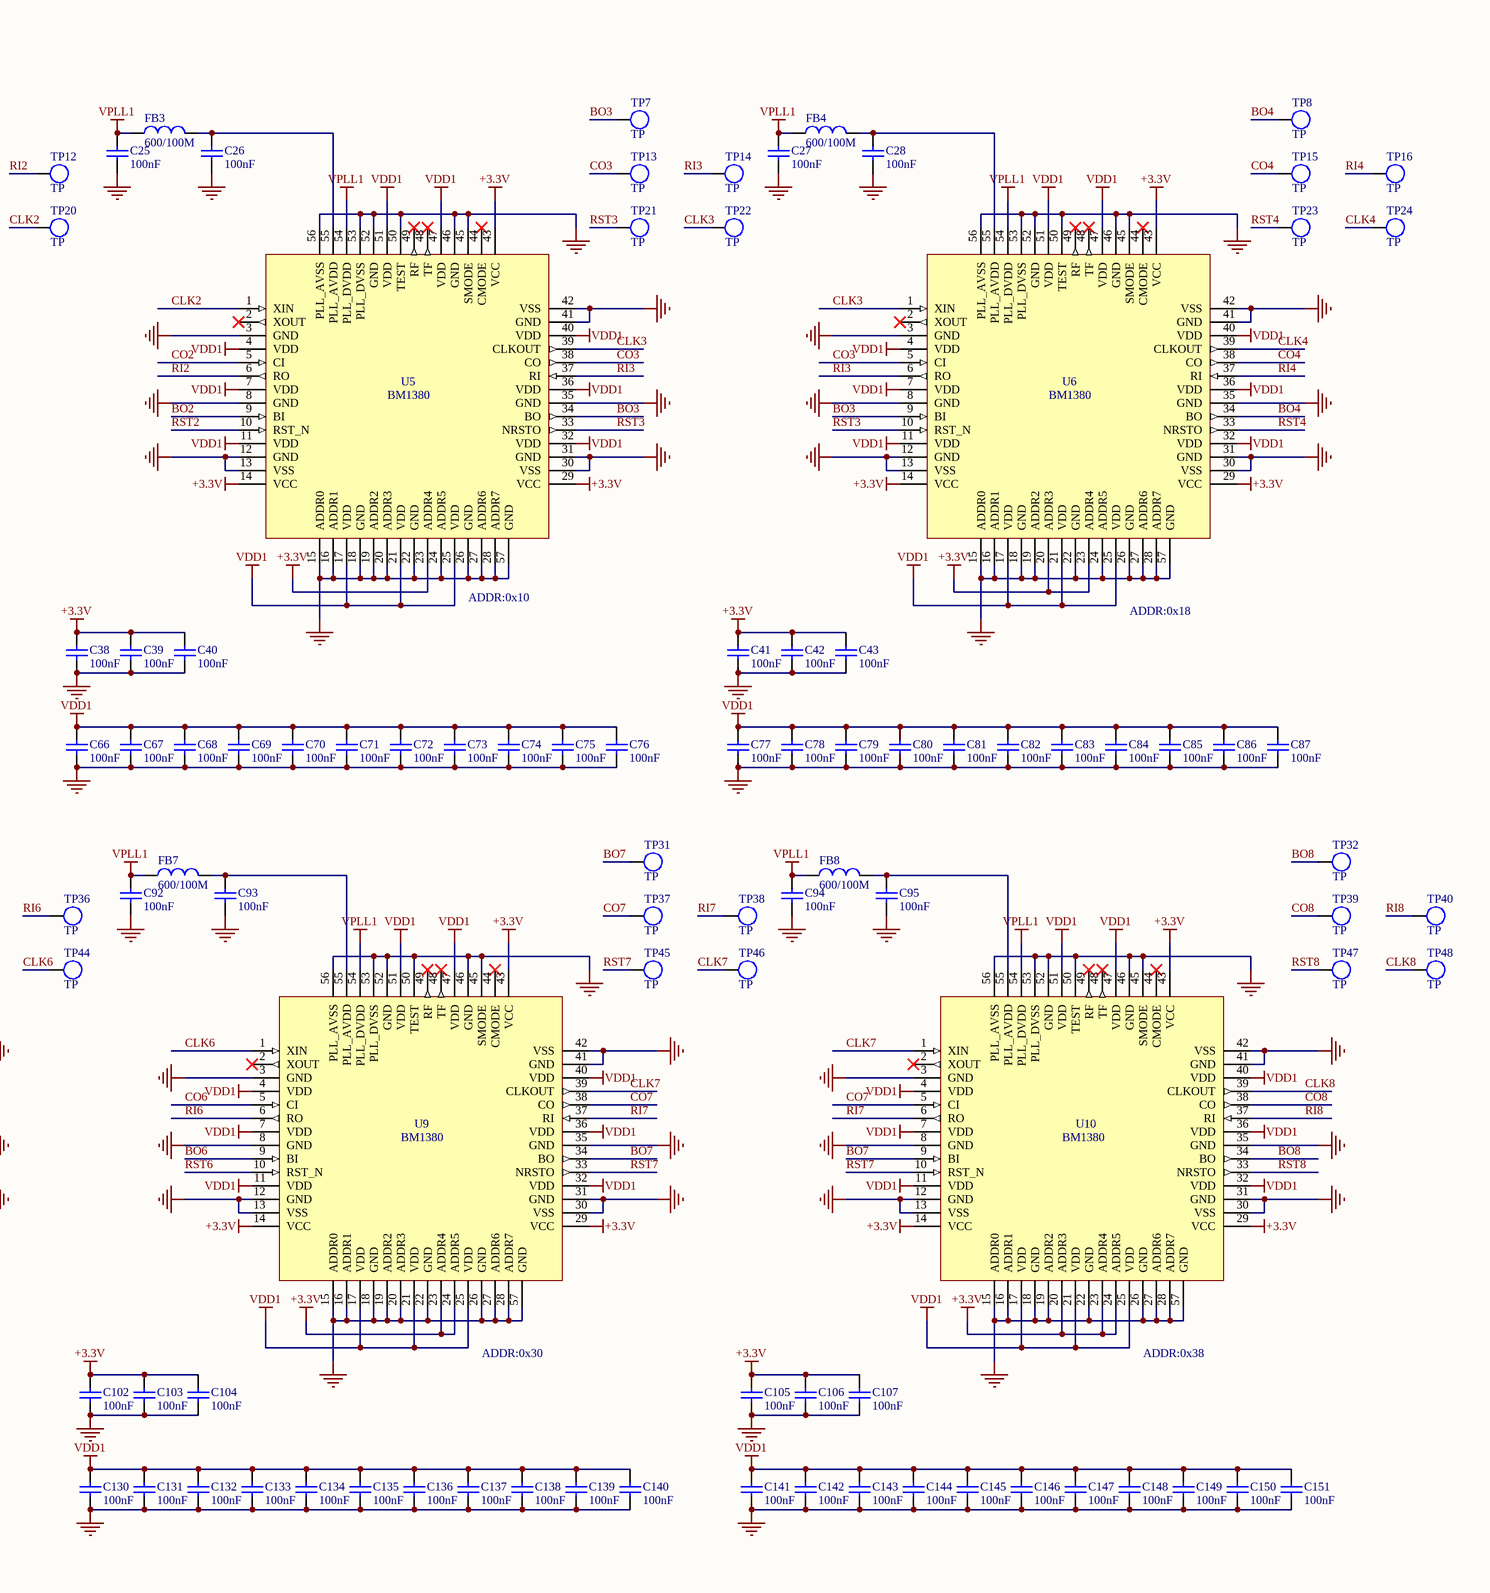
[diagram p6: HashUnit1.SchDoc, right]

### Parts
C17  680uF/6.3V  [D]
C18  680uF/6.3V  [D]
C19  100nF  [CC0603(1608)]
C20  100nF  [CC0603(1608)]
C21  100nF  [CC0603(1608)]
C22  100nF  [CC0603(1608)]
C23  100nF  [CC0603(1608)]
C24  100nF  [CC0603(1608)]
C25  100nF  [CC0603(1608)]
C26  100nF  [CC0603(1608)]
C27  100nF  [CC0603(1608)]
C28  100nF  [CC0603(1608)]
C29  8pF  [CC0603(1608)]
C30  8pF  [CC0603(1608)]
C31  10uF  [CC0603(1608)]
C32  100nF  [CC0603(1608)]
C33  100nF  [CC0603(1608)]
C34  100nF  [CC0603(1608)]
C35  100nF  [CC0603(1608)]
C36  100nF  [CC0603(1608)]
C37  100nF  [CC0603(1608)]
C38  100nF  [CC0603(1608)]
C39  100nF  [CC0603(1608)]
C40  100nF  [CC0603(1608)]
C41  100nF  [CC0603(1608)]
C42  100nF  [CC0603(1608)]
C43  100nF  [CC0603(1608)]
C44  100nF  [CC0603(1608)]
C45  100nF  [CC0603(1608)]
C46  100nF  [CC0603(1608)]
C47  100nF  [CC0603(1608)]
C48  100nF  [CC0603(1608)]
C49  100nF  [CC0603(1608)]
C50  100nF  [CC0603(1608)]
C51  100nF  [CC0603(1608)]
C52  100nF  [CC0603(1608)]
C53  100nF  [CC0603(1608)]
C54  100nF  [CC0603(1608)]
C55  100nF  [CC0603(1608)]
C56  100nF  [CC0603(1608)]
C57  100nF  [CC0603(1608)]
C58  100nF  [CC0603(1608)]
C59  100nF  [CC0603(1608)]
C60  100nF  [CC0603(1608)]
C61  100nF  [CC0603(1608)]
C62  100nF  [CC0603(1608)]
C63  100nF  [CC0603(1608)]
C64  100nF  [CC0603(1608)]
C65  100nF  [CC0603(1608)]
C66  100nF  [CC0603(1608)]
C67  100nF  [CC0603(1608)]
C68  100nF  [CC0603(1608)]
C69  100nF  [CC0603(1608)]
C70  100nF  [CC0603(1608)]
C71  100nF  [CC0603(1608)]
C72  100nF  [CC0603(1608)]
C73  100nF  [CC0603(1608)]
C74  100nF  [CC0603(1608)]
C75  100nF  [CC0603(1608)]
C76  100nF  [CC0603(1608)]
C77  100nF  [CC0603(1608)]
C78  100nF  [CC0603(1608)]
C79  100nF  [CC0603(1608)]
C80  100nF  [CC0603(1608)]
C81  100nF  [CC0603(1608)]
C82  100nF  [CC0603(1608)]
C83  100nF  [CC0603(1608)]
C84  100nF  [CC0603(1608)]
C85  100nF  [CC0603(1608)]
C86  100nF  [CC0603(1608)]
C87  100nF  [CC0603(1608)]
C88  100nF  [CC0603(1608)]
C89  100nF  [CC0603(1608)]
C90  100nF  [CC0603(1608)]
C91  100nF  [CC0603(1608)]
C92  100nF  [CC0603(1608)]
C93  100nF  [CC0603(1608)]
C94  100nF  [CC0603(1608)]
C95  100nF  [CC0603(1608)]
C96  100nF  [CC0603(1608)]
C97  100nF  [CC0603(1608)]
C98  100nF  [CC0603(1608)]
C99  100nF  [CC0603(1608)]
C100  100nF  [CC0603(1608)]
C101  100nF  [CC0603(1608)]
C102  100nF  [CC0603(1608)]
C103  100nF  [CC0603(1608)]
C104  100nF  [CC0603(1608)]
C105  100nF  [CC0603(1608)]
C106  100nF  [CC0603(1608)]
C107  100nF  [CC0603(1608)]
C108  100nF  [CC0603(1608)]
C109  100nF  [CC0603(1608)]
C110  100nF  [CC0603(1608)]
C111  100nF  [CC0603(1608)]
C112  100nF  [CC0603(1608)]
C113  100nF  [CC0603(1608)]
C114  100nF  [CC0603(1608)]
C115  100nF  [CC0603(1608)]
C116  100nF  [CC0603(1608)]
C117  100nF  [CC0603(1608)]
C118  100nF  [CC0603(1608)]
C119  100nF  [CC0603(1608)]
C120  100nF  [CC0603(1608)]
C121  100nF  [CC0603(1608)]
C122  100nF  [CC0603(1608)]
C123  100nF  [CC0603(1608)]
C124  100nF  [CC0603(1608)]
C125  100nF  [CC0603(1608)]
C126  100nF  [CC0603(1608)]
C127  100nF  [CC0603(1608)]
C128  100nF  [CC0603(1608)]
C129  100nF  [CC0603(1608)]
C130  100nF  [CC0603(1608)]
C131  100nF  [CC0603(1608)]
C132  100nF  [CC0603(1608)]
C133  100nF  [CC0603(1608)]
C134  100nF  [CC0603(1608)]
C135  100nF  [CC0603(1608)]
C136  100nF  [CC0603(1608)]
C137  100nF  [CC0603(1608)]
C138  100nF  [CC0603(1608)]
C139  100nF  [CC0603(1608)]
C140  100nF  [CC0603(1608)]
C141  100nF  [CC0603(1608)]
C142  100nF  [CC0603(1608)]
C143  100nF  [CC0603(1608)]
C144  100nF  [CC0603(1608)]
C145  100nF  [CC0603(1608)]
C146  100nF  [CC0603(1608)]
C147  100nF  [CC0603(1608)]
C148  100nF  [CC0603(1608)]
C149  100nF  [CC0603(1608)]
C150  100nF  [CC0603(1608)]
C151  100nF  [CC0603(1608)]
FB1  600/100M  [FB0603(1608)]
FB2  600/100M  [FB0603(1608)]
FB3  600/100M  [FB0603(1608)]
FB4  600/100M  [FB0603(1608)]
FB5  600/100M  [FB0603(1608)]
FB6  600/100M  [FB0603(1608)]
FB7  600/100M  [FB0603(1608)]
FB8  600/100M  [FB0603(1608)]
M4  Mount Hole  [MHOLE2]
M5  Mount Hole  [MHOLE2]
M6  Mount Hole  [MHOLE2]
M7  Mount Hole  [MHOLE2]
M8  Mount Hole  [MHOLE2]
R15  NC  [RR0603(1608)]
R16  1M  [RR0603(1608)]
R17  0  [RR0603(1608)]
R18  10K  [RR0603(1608)]
TP5  TP  [TP_SMD]
TP6  TP  [TP_SMD]
TP7  TP  [TP_SMD]
TP8  TP  [TP_SMD]
TP9  TP  [TP_SMD]
TP10  TP  [TP_SMD]
TP11  TP  [TP_SMD]
TP12  TP  [TP_SMD]
TP13  TP  [TP_SMD]
TP14  TP  [TP_SMD]
TP15  TP  [TP_SMD]
TP16  TP  [TP_SMD]
TP17  TP  [TP_SMD]
TP18  TP  [TP_SMD]
TP19  TP  [TP_SMD]
TP20  TP  [TP_SMD]
TP21  TP  [TP_SMD]
TP22  TP  [TP_SMD]
TP23  TP  [TP_SMD]
TP24  TP  [TP_SMD]
TP25  value XIN  [TP_SMD]  (hidden comment: TP)
TP26  value TXD  [TP_SMD]  (hidden comment: TP)
TP27  value RXD  [TP_SMD]  (hidden comment: TP)
TP28  value RST  [TP_SMD]  (hidden comment: TP)
TP29  TP  [TP_SMD]
TP30  TP  [TP_SMD]
TP31  TP  [TP_SMD]
TP32  TP  [TP_SMD]
TP33  TP  [TP_SMD]
TP34  TP  [TP_SMD]
TP35  TP  [TP_SMD]
TP36  TP  [TP_SMD]
TP37  TP  [TP_SMD]
TP38  TP  [TP_SMD]
TP39  TP  [TP_SMD]
TP40  TP  [TP_SMD]
TP41  TP  [TP_SMD]
TP42  TP  [TP_SMD]
TP43  TP  [TP_SMD]
TP44  TP  [TP_SMD]
TP45  TP  [TP_SMD]
TP46  TP  [TP_SMD]
TP47  TP  [TP_SMD]
TP48  TP  [TP_SMD]
U3  BM1380  [QFN56]
U4  BM1380  [QFN56]
U5  BM1380  [QFN56]
U6  BM1380  [QFN56]
U7  BM1380  [QFN56]
U8  BM1380  [QFN56]
U9  BM1380  [QFN56]
U10  BM1380  [QFN56]
Y1  25MHz  [SMX2]

### Nets
+3.3V: C32.2 C33.2 C34.2 C35.2 C36.2 C37.2 C38.2 C39.2 C40.2 C41.2 C42.2 C43.2 C96.2 C97.2 C98.2 C99.2 C100.2 C101.2 C102.2 C103.2 C104.2 C105.2 C106.2 C107.2 R15.1 R18.2 U3.14(VCC) U3.29(VCC) U3.43(VCC) U4.14(VCC) U4.20(ADDR3) U4.29(VCC) U4.43(VCC) U5.14(VCC) U5.23(ADDR4) U5.29(VCC) U5.43(VCC) U6.14(VCC) U6.20(ADDR3) U6.23(ADDR4) U6.29(VCC) U6.43(VCC) U7.14(VCC) U7.24(ADDR5) U7.29(VCC) U7.43(VCC) U8.14(VCC) U8.20(ADDR3) U8.24(ADDR5) U8.29(VCC) U8.43(VCC) U9.14(VCC) U9.23(ADDR4) U9.24(ADDR5) U9.29(VCC) U9.43(VCC) U10.14(VCC) U10.20(ADDR3) U10.23(ADDR4) U10.24(ADDR5) U10.29(VCC) U10.43(VCC)
GND: C17.2 C18.2 C19.1 C20.1 C21.2 C22.1 C23.2 C24.1 C25.2 C26.1 C27.2 C28.1 C29.2 C30.2 C31.2 C32.1 C33.1 C34.1 C35.1 C36.1 C37.1 C38.1 C39.1 C40.1 C41.1 C42.1 C43.1 C44.1 C45.1 C46.1 C47.1 C48.1 C49.1 C50.1 C51.1 C52.1 C53.1 C54.1 C55.1 C56.1 C57.1 C58.1 C59.1 C60.1 C61.1 C62.1 C63.1 C64.1 C65.1 C66.1 C67.1 C68.1 C69.1 C70.1 C71.1 C72.1 C73.1 C74.1 C75.1 C76.1 C77.1 C78.1 C79.1 C80.1 C81.1 C82.1 C83.1 C84.1 C85.1 C86.1 C87.1 C88.2 C89.1 C90.2 C91.1 C92.2 C93.1 C94.2 C95.1 C96.1 C97.1 C98.1 C99.1 C100.1 C101.1 C102.1 C103.1 C104.1 C105.1 C106.1 C107.1 C108.1 C109.1 C110.1 C111.1 C112.1 C113.1 C114.1 C115.1 C116.1 C117.1 C118.1 C119.1 C120.1 C121.1 C122.1 C123.1 C124.1 C125.1 C126.1 C127.1 C128.1 C129.1 C130.1 C131.1 C132.1 C133.1 C134.1 C135.1 C136.1 C137.1 C138.1 C139.1 C140.1 C141.1 C142.1 C143.1 C144.1 C145.1 C146.1 C147.1 C148.1 C149.1 C150.1 C151.1 M4.0(PIN) M5.0(PIN) M6.0(PIN) M7.0(PIN) M8.0(PIN) U3.3(GND) U3.8(GND) U3.9(BI) U3.12(GND) U3.13(VSS) U3.15(ADDR0) U3.16(ADDR1) U3.18(GND) U3.19(ADDR2) U3.20(ADDR3) U3.22(GND) U3.23(ADDR4) U3.24(ADDR5) U3.26(GND) U3.27(ADDR6) U3.28(ADDR7) U3.30(VSS) U3.31(GND) U3.35(GND) U3.41(GND) U3.42(VSS) U3.45(SMODE) U3.46(GND) U3.50(TEST) U3.52(GND) U3.53(PLL_DVSS) U3.56(PLL_AVSS) U3.57(GND) U4.3(GND) U4.8(GND) U4.12(GND) U4.13(VSS) U4.15(ADDR0) U4.16(ADDR1) U4.18(GND) U4.19(ADDR2) U4.22(GND) U4.23(ADDR4) U4.24(ADDR5) U4.26(GND) U4.27(ADDR6) U4.28(ADDR7) U4.30(VSS) U4.31(GND) U4.35(GND) U4.41(GND) U4.42(VSS) U4.45(SMODE) U4.46(GND) U4.50(TEST) U4.52(GND) U4.53(PLL_DVSS) U4.56(PLL_AVSS) U4.57(GND) U5.3(GND) U5.8(GND) U5.12(GND) U5.13(VSS) U5.15(ADDR0) U5.16(ADDR1) U5.18(GND) U5.19(ADDR2) U5.20(ADDR3) U5.22(GND) U5.24(ADDR5) U5.26(GND) U5.27(ADDR6) U5.28(ADDR7) U5.30(VSS) U5.31(GND) U5.35(GND) U5.41(GND) U5.42(VSS) U5.45(SMODE) U5.46(GND) U5.50(TEST) U5.52(GND) U5.53(PLL_DVSS) U5.56(PLL_AVSS) U5.57(GND) U6.3(GND) U6.8(GND) U6.12(GND) U6.13(VSS) U6.15(ADDR0) U6.16(ADDR1) U6.18(GND) U6.19(ADDR2) U6.22(GND) U6.24(ADDR5) U6.26(GND) U6.27(ADDR6) U6.28(ADDR7) U6.30(VSS) U6.31(GND) U6.35(GND) U6.41(GND) U6.42(VSS) U6.45(SMODE) U6.46(GND) U6.50(TEST) U6.52(GND) U6.53(PLL_DVSS) U6.56(PLL_AVSS) U6.57(GND) U7.3(GND) U7.8(GND) U7.12(GND) U7.13(VSS) U7.15(ADDR0) U7.16(ADDR1) U7.18(GND) U7.19(ADDR2) U7.20(ADDR3) U7.22(GND) U7.23(ADDR4) U7.26(GND) U7.27(ADDR6) U7.28(ADDR7) U7.30(VSS) U7.31(GND) U7.35(GND) U7.41(GND) U7.42(VSS) U7.45(SMODE) U7.46(GND) U7.50(TEST) U7.52(GND) U7.53(PLL_DVSS) U7.56(PLL_AVSS) U7.57(GND) U8.3(GND) U8.8(GND) U8.12(GND) U8.13(VSS) U8.15(ADDR0) U8.16(ADDR1) U8.18(GND) U8.19(ADDR2) U8.22(GND) U8.23(ADDR4) U8.26(GND) U8.27(ADDR6) U8.28(ADDR7) U8.30(VSS) U8.31(GND) U8.35(GND) U8.41(GND) U8.42(VSS) U8.45(SMODE) U8.46(GND) U8.50(TEST) U8.52(GND) U8.53(PLL_DVSS) U8.56(PLL_AVSS) U8.57(GND) U9.3(GND) U9.8(GND) U9.12(GND) U9.13(VSS) U9.15(ADDR0) U9.16(ADDR1) U9.18(GND) U9.19(ADDR2) U9.20(ADDR3) U9.22(GND) U9.26(GND) U9.27(ADDR6) U9.28(ADDR7) U9.30(VSS) U9.31(GND) U9.35(GND) U9.41(GND) U9.42(VSS) U9.45(SMODE) U9.46(GND) U9.50(TEST) U9.52(GND) U9.53(PLL_DVSS) U9.56(PLL_AVSS) U9.57(GND) U10.3(GND) U10.8(GND) U10.12(GND) U10.13(VSS) U10.15(ADDR0) U10.16(ADDR1) U10.18(GND) U10.19(ADDR2) U10.22(GND) U10.26(GND) U10.27(ADDR6) U10.28(ADDR7) U10.30(VSS) U10.31(GND) U10.35(GND) U10.41(GND) U10.42(VSS) U10.45(SMODE) U10.46(GND) U10.50(TEST) U10.52(GND) U10.53(PLL_DVSS) U10.56(PLL_AVSS) U10.57(GND)
VDD1: C17.1 C18.1 C19.2 C20.2 C44.2 C45.2 C46.2 C47.2 C48.2 C49.2 C50.2 C51.2 C52.2 C53.2 C54.2 C55.2 C56.2 C57.2 C58.2 C59.2 C60.2 C61.2 C62.2 C63.2 C64.2 C65.2 C66.2 C67.2 C68.2 C69.2 C70.2 C71.2 C72.2 C73.2 C74.2 C75.2 C76.2 C77.2 C78.2 C79.2 C80.2 C81.2 C82.2 C83.2 C84.2 C85.2 C86.2 C87.2 C108.2 C109.2 C110.2 C111.2 C112.2 C113.2 C114.2 C115.2 C116.2 C117.2 C118.2 C119.2 C120.2 C121.2 C122.2 C123.2 C124.2 C125.2 C126.2 C127.2 C128.2 C129.2 C130.2 C131.2 C132.2 C133.2 C134.2 C135.2 C136.2 C137.2 C138.2 C139.2 C140.2 C141.2 C142.2 C143.2 C144.2 C145.2 C146.2 C147.2 C148.2 C149.2 C150.2 C151.2 U3.4(VDD) U3.7(VDD) U3.11(VDD) U3.17(VDD) U3.21(VDD) U3.25(VDD) U3.32(VDD) U3.36(VDD) U3.40(VDD) U3.47(VDD) U3.51(VDD) U4.4(VDD) U4.7(VDD) U4.11(VDD) U4.17(VDD) U4.21(VDD) U4.25(VDD) U4.32(VDD) U4.36(VDD) U4.40(VDD) U4.47(VDD) U4.51(VDD) U5.4(VDD) U5.7(VDD) U5.11(VDD) U5.17(VDD) U5.21(VDD) U5.25(VDD) U5.32(VDD) U5.36(VDD) U5.40(VDD) U5.47(VDD) U5.51(VDD) U6.4(VDD) U6.7(VDD) U6.11(VDD) U6.17(VDD) U6.21(VDD) U6.25(VDD) U6.32(VDD) U6.36(VDD) U6.40(VDD) U6.47(VDD) U6.51(VDD) U7.4(VDD) U7.7(VDD) U7.11(VDD) U7.17(VDD) U7.21(VDD) U7.25(VDD) U7.32(VDD) U7.36(VDD) U7.40(VDD) U7.47(VDD) U7.51(VDD) U8.4(VDD) U8.7(VDD) U8.11(VDD) U8.17(VDD) U8.21(VDD) U8.25(VDD) U8.32(VDD) U8.36(VDD) U8.40(VDD) U8.47(VDD) U8.51(VDD) U9.4(VDD) U9.7(VDD) U9.11(VDD) U9.17(VDD) U9.21(VDD) U9.25(VDD) U9.32(VDD) U9.36(VDD) U9.40(VDD) U9.47(VDD) U9.51(VDD) U10.4(VDD) U10.7(VDD) U10.11(VDD) U10.17(VDD) U10.21(VDD) U10.25(VDD) U10.32(VDD) U10.36(VDD) U10.40(VDD) U10.47(VDD) U10.51(VDD)
VPLL1: C21.1 C23.1 C25.1 C27.1 C88.1 C90.1 C92.1 C94.1 FB1.2 FB2.2 FB3.2 FB4.2 FB5.2 FB6.2 FB7.2 FB8.2 U3.54(PLL_DVDD) U4.54(PLL_DVDD) U5.54(PLL_DVDD) U6.54(PLL_DVDD) U7.54(PLL_DVDD) U8.54(PLL_DVDD) U9.54(PLL_DVDD) U10.54(PLL_DVDD)
BO1: TP5.1 U3.34(BO) U4.9(BI)
BO2: TP6.1 U4.34(BO) U5.9(BI)
BO3: TP7.1 U5.34(BO) U6.9(BI)
BO4: TP8.1 U6.34(BO) U7.9(BI)
BO5: TP29.1 U7.34(BO) U8.9(BI)
BO6: TP30.1 U8.34(BO) U9.9(BI)
BO7: TP31.1 U9.34(BO) U10.9(BI)
BO8: TP32.1 U10.34(BO)
CLK1: TP18.1 U3.39(CLKOUT) U4.1(XIN)
CLK2: TP20.1 U4.39(CLKOUT) U5.1(XIN)
CLK3: TP22.1 U5.39(CLKOUT) U6.1(XIN)
CLK4: TP24.1 U6.39(CLKOUT) U7.1(XIN)
CLK5: TP42.1 U7.39(CLKOUT) U8.1(XIN)
CLK6: TP44.1 U8.39(CLKOUT) U9.1(XIN)
CLK7: TP46.1 U9.39(CLKOUT) U10.1(XIN)
CLK8: TP48.1 U10.39(CLKOUT)
CO1: TP9.1 U3.38(CO) U4.5(CI)
CO2: TP11.1 U4.38(CO) U5.5(CI)
CO3: TP13.1 U5.38(CO) U6.5(CI)
CO4: TP15.1 U6.38(CO) U7.5(CI)
CO5: TP33.1 U7.38(CO) U8.5(CI)
CO6: TP35.1 U8.38(CO) U9.5(CI)
CO7: TP37.1 U9.38(CO) U10.5(CI)
CO8: TP39.1 U10.38(CO)
RI1: TP10.1 U3.37(RI) U4.6(RO)
RI2: TP12.1 U4.37(RI) U5.6(RO)
RI3: TP14.1 U5.37(RI) U6.6(RO)
RI4: TP16.1 U6.37(RI) U7.6(RO)
RI5: TP34.1 U7.37(RI) U8.6(RO)
RI6: TP36.1 U8.37(RI) U9.6(RO)
RI7: TP38.1 U9.37(RI) U10.6(RO)
RI8: TP40.1 U10.37(RI)
RST: C31.1 R18.1 TP28.1 U3.10(RST_N)
RST1: TP17.1 U3.33(NRSTO) U4.10(RST_N)
RST2: TP19.1 U4.33(NRSTO) U5.10(RST_N)
RST3: TP21.1 U5.33(NRSTO) U6.10(RST_N)
RST4: TP23.1 U6.33(NRSTO) U7.10(RST_N)
RST5: TP41.1 U7.33(NRSTO) U8.10(RST_N)
RST6: TP43.1 U8.33(NRSTO) U9.10(RST_N)
RST7: TP45.1 U9.33(NRSTO) U10.10(RST_N)
RST8: TP47.1 U10.33(NRSTO)
RXD: TP27.1 U3.6(RO)
TXD: R15.2 TP26.1 U3.5(CI)
XIN: C29.1 R16.2 TP25.1 U3.1(XIN) Y1.1(OSC1)
XOUT: R16.1 R17.1 U3.2(XOUT)
NetC22_2: C22.2 FB1.1 U3.55(PLL_AVDD)
NetC24_2: C24.2 FB2.1 U4.55(PLL_AVDD)
NetC26_2: C26.2 FB3.1 U5.55(PLL_AVDD)
NetC28_2: C28.2 FB4.1 U6.55(PLL_AVDD)
NetC30_1: C30.1 R17.2 Y1.3(OSC2)
NetC89_2: C89.2 FB5.1 U7.55(PLL_AVDD)
NetC91_2: C91.2 FB6.1 U8.55(PLL_AVDD)
NetC93_2: C93.2 FB7.1 U9.55(PLL_AVDD)
NetC95_2: C95.2 FB8.1 U10.55(PLL_AVDD)

Not connected (* = marked no-connect by the designer): U3 44(CMODE)* 48(TF)* 49(RF)*; U4 2(XOUT)* 44(CMODE)* 48(TF)* 49(RF)*; U5 2(XOUT)* 44(CMODE)* 48(TF)* 49(RF)*; U6 2(XOUT)* 44(CMODE)* 48(TF)* 49(RF)*; U7 2(XOUT)* 44(CMODE)* 48(TF)* 49(RF)*; U8 2(XOUT)* 44(CMODE)* 48(TF)* 49(RF)*; U9 2(XOUT)* 44(CMODE)* 48(TF)* 49(RF)*; U10 2(XOUT)* 44(CMODE)* 48(TF)* 49(RF)*

### Notes on the sheet
- ADDR:0x00
- ADDR:0x08
- ADDR:0x10
- ADDR:0x18
- ADDR:0x20
- ADDR:0x28
- ADDR:0x30
- ADDR:0x38

### Library data of the parts
C17 C18 = T492C: Solid Tantalum Chip Capacitor, T492 Series - CWR11 Style Per Mil-PRF-55365/8; Published: 17-Jul-2002; LatestRevisionDate: 19-Mar-2004; LatestRevisionNote: Silkscreen dimensions re-sized.; DatasheetDocument: Mar-2001; PackageDocument: Mar-2001; PackageReference: C; Publisher: Altium Limited; Code_JEITA: 6032-28; ComponentLink1Description: Manufacturer Link; ComponentLink1URL: http://www.kemet.com/; ComponentLink2Description: Datasheet; ComponentLink2URL: http://www.kemet.com/kemet/web/homepage/kechome.nsf/vapubfilesname/F3102TA.pdf/$file/F3102TA.pdf; Value: 680uF/6.3V
C19 C20 = Cap Semi: Capacitor (Semiconductor SIM Model); Published: 8-Jun-2000; LatestRevisionDate: 29-May-2009; LatestRevisionNote: IPC-7351 Footprint Added.; PackageReference: C1206; Publisher: Altium Limited; PackageDescription: Chip Capacitor; Value: 100nF
C21-C151 = Cap: Capacitor; Published: 8-Jun-2000; LatestRevisionDate: 17-Jul-2002; LatestRevisionNote: Re-released for DXP Platform.; PackageReference: RAD-0.3; Publisher: Altium Limited; PackageDescription: Radial Cap, Thru-Hole; 2 Leads; 0.3 in Pin Spacing
  C21-C28 C32-C151: Value: 100nF
  C29 C30: Value: 8pF
  C31: Value: 10uF
FB1-FB8 = FB: Inductor; Code_IEC: 1005; Published: 8-Jun-2000; LatestRevisionDate: 29-May-2009; LatestRevisionNote: IPC-7351 Footprint Added.; PackageReference: 0402-A; Publisher: Altium Limited; PackageDescription: Chip Inductor; Code_JEITA: 0402; Value: 600/100M
M4-M8 = M_Hole
R15-R18 = Res1: Resistor; Published: 8-Jun-2000; LatestRevisionDate: 17-Jul-2002; LatestRevisionNote: Re-released for DXP Platform.; PackageReference: AXIAL-0.3; Publisher: Altium Limited; PackageDescription: Axial Device, Thru-Hole; 2 Leads; 0.3 in Pin Spacing
  R15: Value: NC
  R16: Value: 1M
  R17: Value: 0
  R18: Value: 10K
TP5-TP48 = TP: Test Point
  TP5-TP24 TP29-TP48: Value: TP
Y1 = XTAL: Crystal Oscillator; Published: 8-Jun-2000; LatestRevisionDate: 17-Jul-2002; LatestRevisionNote: Re-released for DXP Platform.; PackageReference: R38; Publisher: Altium Limited; PackageDescription: Crystal, Thru-Hole; 2 Leads; Body 3.1 x 8.2 mm (Dia.xH); Value: 25MHz